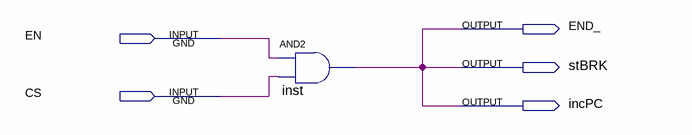
[diagram p0: schematic sheet]
// Quartus schematic BRK.bdf as structural Verilog: 1 symbols, 5 pins
module BRK (
  input  EN,
  input  CS,
  output END_,
  output stBRK,
  output incPC
);

  and inst (END_, EN, CS);

  assign incPC = END_;
  assign stBRK = END_;
endmodule
